# EAGLE design 509_outin_jetson (EAGLE 9.6.2)
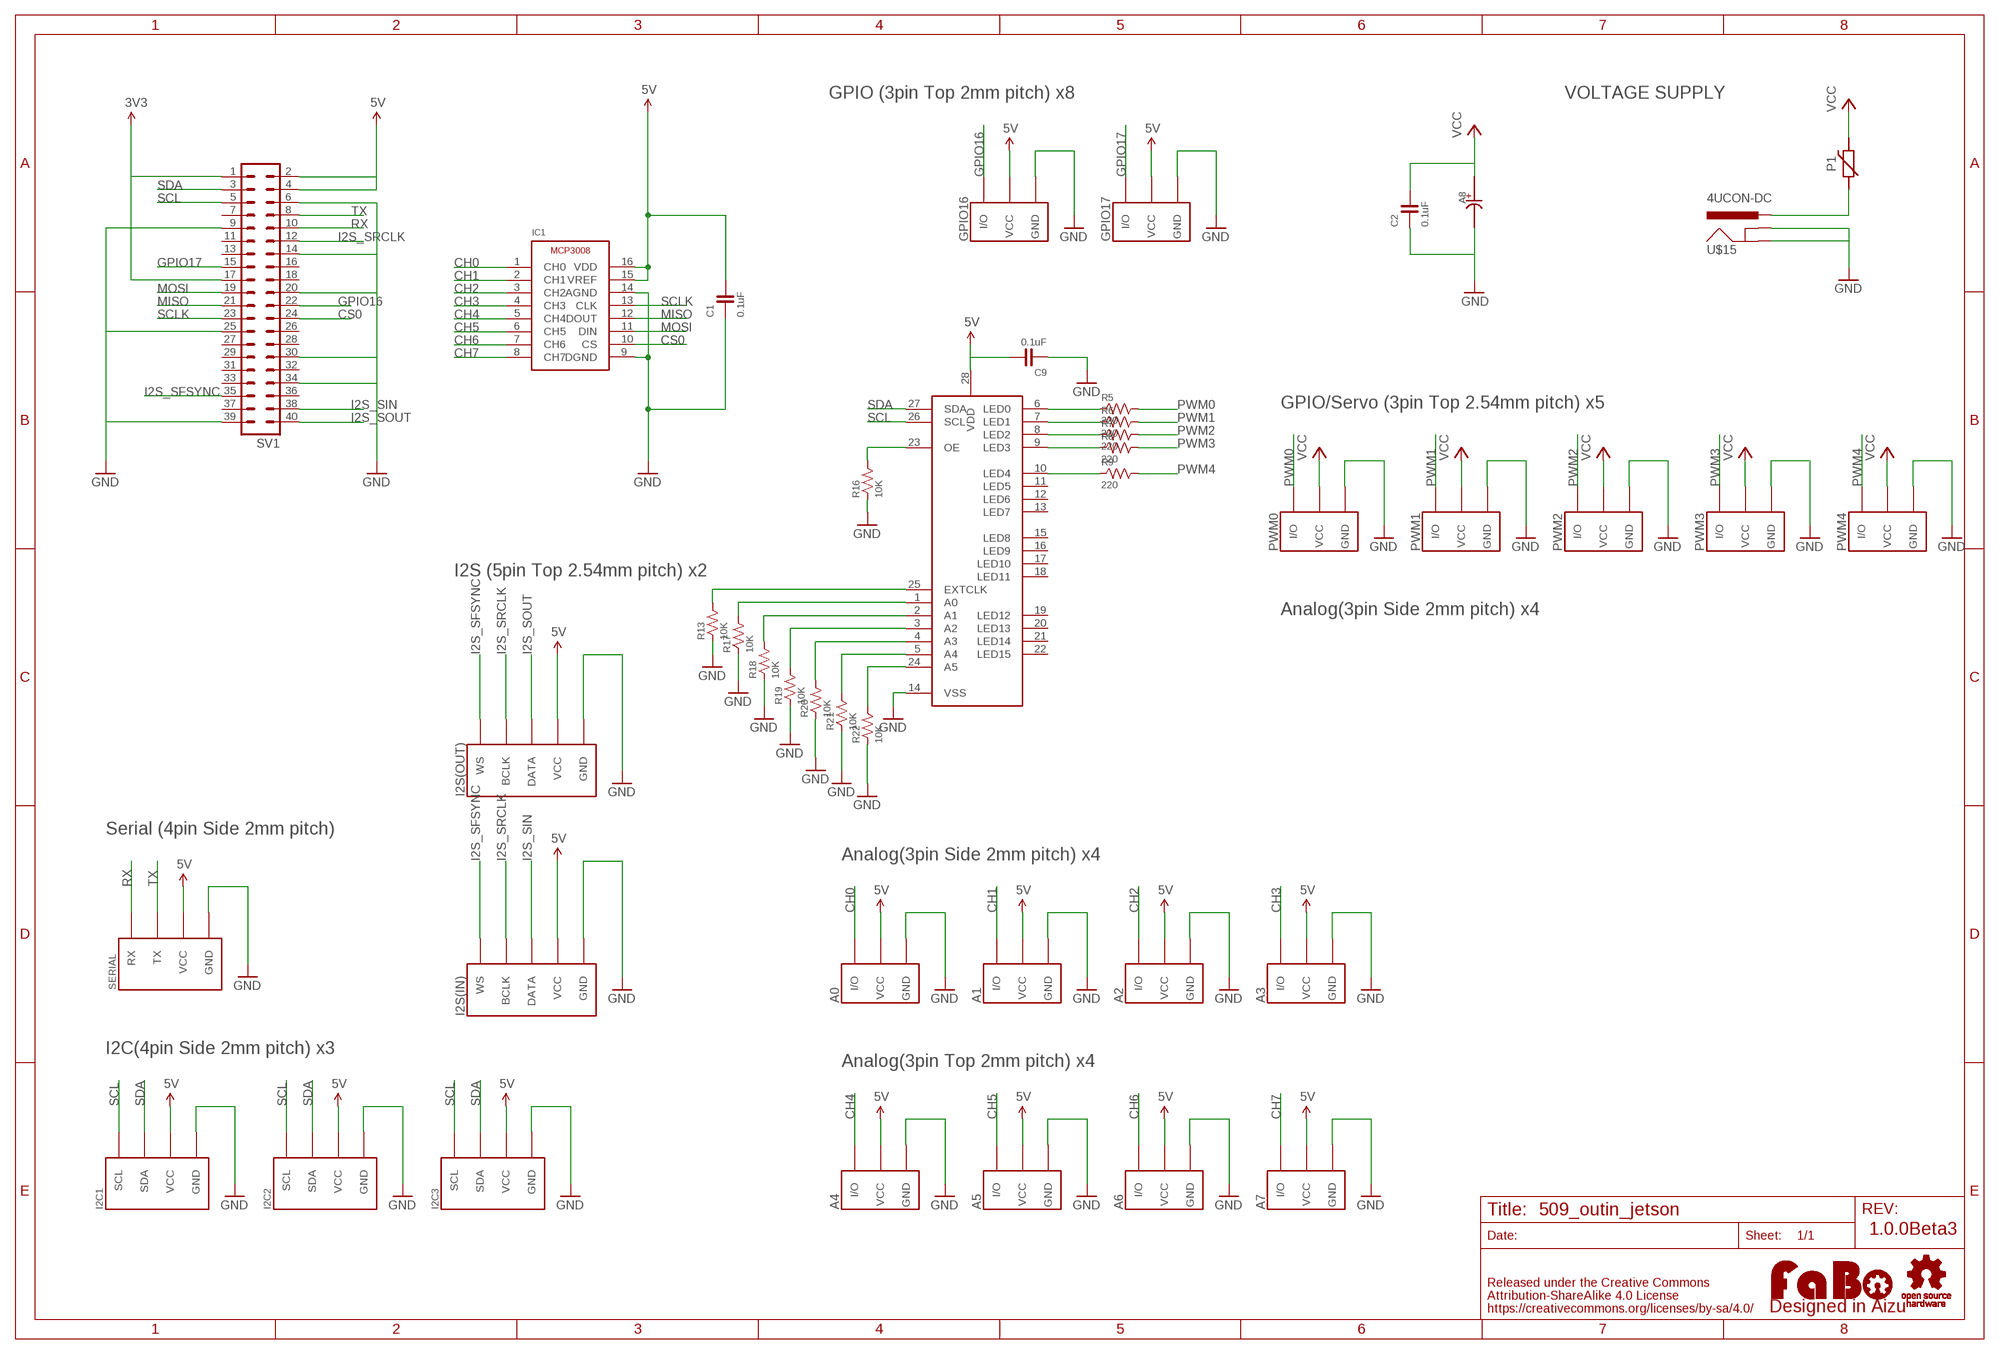
[diagram p0: schematic, sheet 1]

## Parts
A0  FABO_BRICK_3PIN-S03B-PASK-2  [FABO_BRICK_3PIN_S03B-PASK-2]
A1  FABO_BRICK_3PIN-S03B-PASK-2  [FABO_BRICK_3PIN_S03B-PASK-2]
A2  FABO_BRICK_3PIN-S03B-PASK-2  [FABO_BRICK_3PIN_S03B-PASK-2]
A3  FABO_BRICK_3PIN-S03B-PASK-2  [FABO_BRICK_3PIN_S03B-PASK-2]
A4  FABO_BRICK_3PIN-B03B-PASK-1  [FABO_BRICK_3PIN_B03B-PASK-1]
A5  FABO_BRICK_3PIN-B03B-PASK-1  [FABO_BRICK_3PIN_B03B-PASK-1]
A6  FABO_BRICK_3PIN-B03B-PASK-1  [FABO_BRICK_3PIN_B03B-PASK-1]
A7  FABO_BRICK_3PIN-B03B-PASK-1  [FABO_BRICK_3PIN_B03B-PASK-1]
A8  CAPACITOR-ALUMIN_H13  [H13]
C1  0.1uF  CAPACITOR-0603  [0603]
C2  0.1uF  CAPACITOR-0603  [0603]
C9  0.1uF  CAPACITOR-0603  [0603]
GPIO16  FABO_BRICK_3PIN-B03B-PASK-1  [FABO_BRICK_3PIN_B03B-PASK-1]
GPIO17  FABO_BRICK_3PIN-B03B-PASK-1  [FABO_BRICK_3PIN_B03B-PASK-1]
I2C1  FABO_BRICK_I2C-S04B-PASK-2  [FABO_BRICK_I2C_S04B-PASK-2]
I2C2  FABO_BRICK_I2C-S04B-PASK-2  [FABO_BRICK_I2C_S04B-PASK-2]
I2C3  FABO_BRICK_I2C-S04B-PASK-2  [FABO_BRICK_I2C_S04B-PASK-2]
I2S(IN)  FABO_BRICK_I2SLONG  [FABO_BRICK_I2S_S05B-PASK-2_LONG]
I2S(OUT)  FABO_BRICK_I2SLONG  [FABO_BRICK_I2S_S05B-PASK-2_LONG]
IC1  MICROCHIP-MCP3008  [MICROCHIP-MCP3008]
LOGO1  LOGO_FABO-M  [LOGO_FABO_M]
P1  POLYSWITCHMF-NSML1  [1206]
PWM0  FABO_BRICK_3PIN-HEADER  [FABO_BRICK_3PIN_HEADER]
PWM1  FABO_BRICK_3PIN-HEADER  [FABO_BRICK_3PIN_HEADER]
PWM2  FABO_BRICK_3PIN-HEADER  [FABO_BRICK_3PIN_HEADER]
PWM3  FABO_BRICK_3PIN-HEADER  [FABO_BRICK_3PIN_HEADER]
PWM4  FABO_BRICK_3PIN-HEADER  [FABO_BRICK_3PIN_HEADER]
R5  220  RESISTOR-0603  [0603]
R6  220  RESISTOR-0603  [0603]
R7  220  RESISTOR-0603  [0603]
R8  220  RESISTOR-0603  [0603]
R9  220  RESISTOR-0603  [0603]
R13  10K  RESISTOR-0402  [0402]
R16  10K  RESISTOR-0603  [0603]
R17  10K  RESISTOR-0402  [0402]
R18  10K  RESISTOR-0402  [0402]
R19  10K  RESISTOR-0402  [0402]
R20  10K  RESISTOR-0402  [0402]
R21  10K  RESISTOR-0402  [0402]
R22  10K  RESISTOR-0402  [0402]
SERIAL  FABO_BRICK_SERIAL-S04B-PASK-2  [FABO_BRICK_SERIAL_S04B-PASK-2]
SV1  MA20-2  [MA20-2]
U$4  LOGO_OSHW-T_M_BOTTOM  [LOGO_OSHW_T_MS_BOTTOM]
U$9  PCA9685  [PCA9685]
U$15  4UCON-DC  [4UCON-DC]

## Nets
3V3: SV1.1 SV1.17
5V: A0.VCC A1.VCC A2.VCC A3.VCC A4.VCC A5.VCC A6.VCC A7.VCC C1.2 C9.2 GPIO16.VCC GPIO17.VCC I2C1.VCC I2C2.VCC I2C3.VCC I2S(IN).VCC I2S(OUT).VCC IC1.15(VREF) IC1.16(VDD) SERIAL.VCC SV1.2 SV1.4 U$9.28(VDD)
CH0: A0.I/O IC1.1(CH0)
CH1: A1.I/O IC1.2(CH1)
CH2: A2.I/O IC1.3(CH2)
CH3: A3.I/O IC1.4(CH3)
CH4: A4.I/O IC1.5(CH4)
CH5: A5.I/O IC1.6(CH5)
CH6: A6.I/O IC1.7(CH6)
CH7: A7.I/O IC1.8(CH7)
CS0: IC1.10(CS) SV1.24
GND: A0.GND A1.GND A2.GND A3.GND A4.GND A5.GND A6.GND A7.GND A8.MINUS(-) C1.1 C2.1 C9.1 GPIO16.GND GPIO17.GND I2C1.GND I2C2.GND I2C3.GND I2S(IN).GND I2S(OUT).GND IC1.9(DGND) IC1.14(AGND) PWM0.GND PWM1.GND PWM2.GND PWM3.GND PWM4.GND R13.P$1 R16.1 R17.P$1 R18.P$1 R19.P$1 R20.P$1 R21.P$1 R22.P$1 SERIAL.GND SV1.6 SV1.9 SV1.14 SV1.20 SV1.25 SV1.30 SV1.34 SV1.39 U$9.14(VSS) U$15.GND1(GND) U$15.GND2(GNDBREAK)
GPIO16: GPIO16.I/O SV1.22
GPIO17: GPIO17.I/O SV1.15
I2S_SFSYNC: I2S(IN).WS I2S(OUT).WS SV1.35
I2S_SIN: I2S(IN).DATA SV1.38
I2S_SOUT: I2S(OUT).DATA SV1.40
I2S_SRCLK: I2S(IN).BCLK I2S(OUT).BCLK SV1.12
LED0: R5.1 U$9.6(LED0)
LED1: R6.1 U$9.7(LED1)
LED2: R7.1 U$9.8(LED2)
LED3: R8.1 U$9.9(LED3)
LED4: R9.1 U$9.10(LED4)
MISO: IC1.12(DOUT) SV1.21
MOSI: IC1.11(DIN) SV1.19
N$1: P1.P$1 U$15.VCC(PWR)
N$7: R16.2 U$9.23(OE)
N$8: R13.P$2 U$9.25(EXTCLK)
N$9: R17.P$2 U$9.1(A0)
N$10: R18.P$2 U$9.2(A1)
N$11: R19.P$2 U$9.3(A2)
N$12: R20.P$2 U$9.4(A3)
N$13: R21.P$2 U$9.5(A4)
N$14: R22.P$2 U$9.24(A5)
PWM0: PWM0.I/O R5.2
PWM1: PWM1.I/O R6.2
PWM2: PWM2.I/O R7.2
PWM3: PWM3.I/O R8.2
PWM4: PWM4.I/O R9.2
RX: SERIAL.RX SV1.10
SCL: I2C1.SCL I2C2.SCL I2C3.SCL SV1.5 U$9.26(SCL)
SCLK: IC1.13(CLK) SV1.23
SDA: I2C1.SDA I2C2.SDA I2C3.SDA SV1.3 U$9.27(SDA)
TX: SERIAL.TX SV1.8
VCC: A8.PLUS(+) C2.2 P1.P$2 PWM0.VCC PWM1.VCC PWM2.VCC PWM3.VCC PWM4.VCC
Unconnected: SV1.7 SV1.11 SV1.13 SV1.16 SV1.18 SV1.26 SV1.27 SV1.28 SV1.29 SV1.31 SV1.32 SV1.33 SV1.36 SV1.37 U$9.11(LED5) U$9.12(LED6) U$9.13(LED7) U$9.15(LED8) U$9.16(LED9) U$9.17(LED10) U$9.18(LED11) U$9.19(LED12) U$9.20(LED13) U$9.21(LED14) U$9.22(LED15)

## Notes on the sheet
- GPIO (3pin Top 2mm pitch) x8 | VOLTAGE SUPPLY
- GPIO/Servo (3pin Top 2.54mm pitch) x5
- I2S (5pin Top 2.54mm pitch) x2
- Analog(3pin Side 2mm pitch) x4
- Serial (4pin Side 2mm pitch)
- Analog(3pin Side 2mm pitch) x4
- I2C(4pin Side 2mm pitch) x3
- Analog(3pin Top 2mm pitch) x4
- 1.0.0Beta3

## Library data of the parts
A0 A1-A7 GPIO16 GPIO17 PWM0 PWM1-PWM4 = FaBo-Template:FABO_BRICK_3PIN: FaBo Brick 3pin
A8 = FaBo-Capacitor:CAPACITOR-ALUMIN
C1 C2 C9 = FaBo-Capacitor:CAPACITOR: CAPACITOR
I2C1-I2C3 = FaBo-Template:FABO_BRICK_I2C: FaBo Brick I2C
I2S(IN) I2S(OUT) = FaBo-Template:FABO_BRICK_I2S
IC1 = FaBo-ADC:MICROCHIP-MCP3008
LOGO1 = component:LOGO_FABO
P1 = FaBo-Supply:POLYSWITCH
R5-R9 R13 R16-R22 = FaBo-Resistors:RESISTOR: RESISTOR
SERIAL = FaBo-Template:FABO_BRICK_SERIAL: FaBo Brick Serial
SV1 = con-lstb:MA20-2: PIN HEADER; OC_FARNELL: unknown; OC_NEWARK: unknown
U$4 = FaBo-etc:LOGO_OSHW
U$9 = FaBo-Motor:PCA9685
U$15 = FaBo-Supply:4UCON-DC

## Board
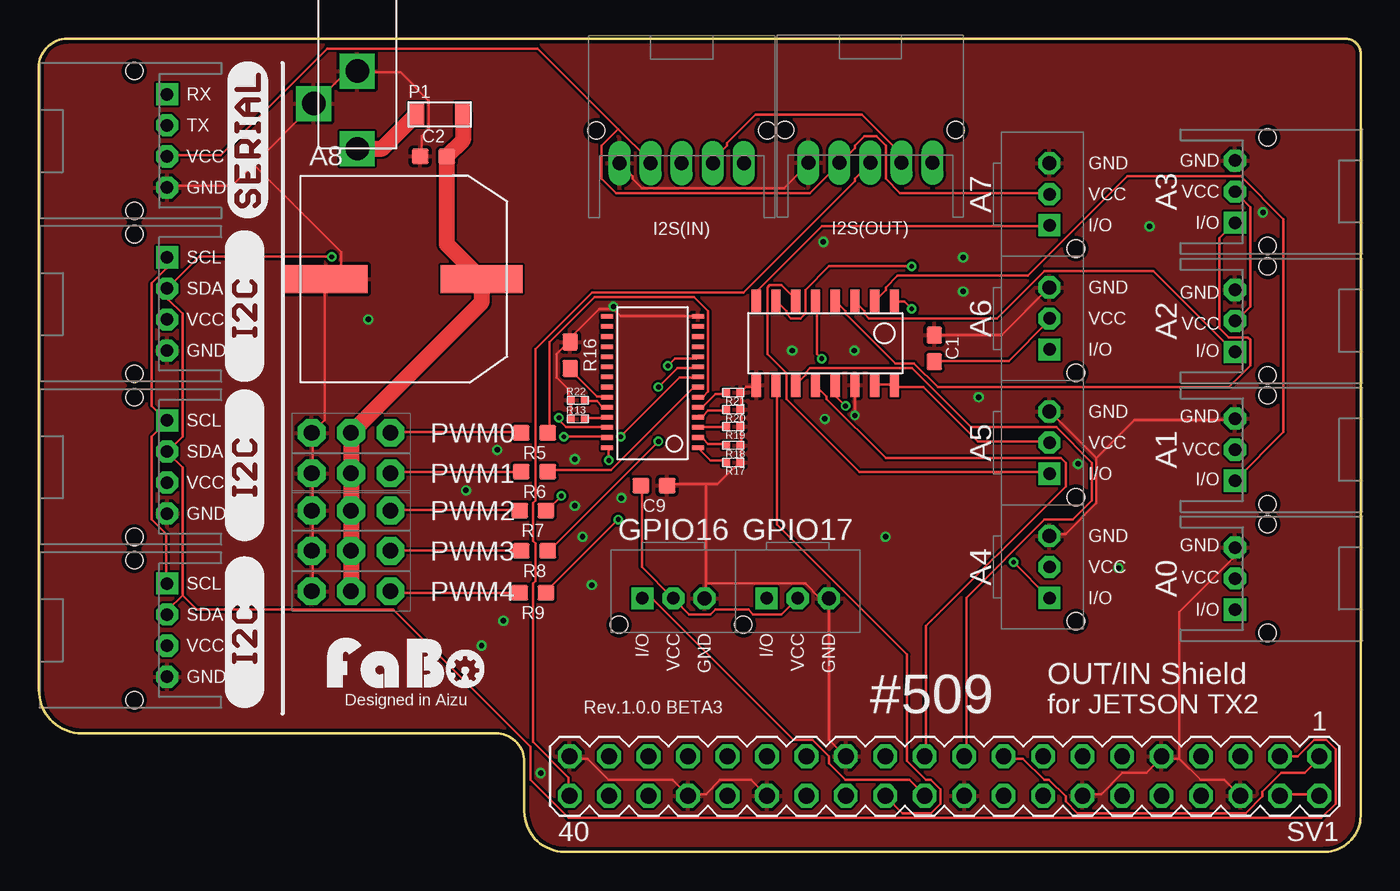
[diagram p1: board, top side]
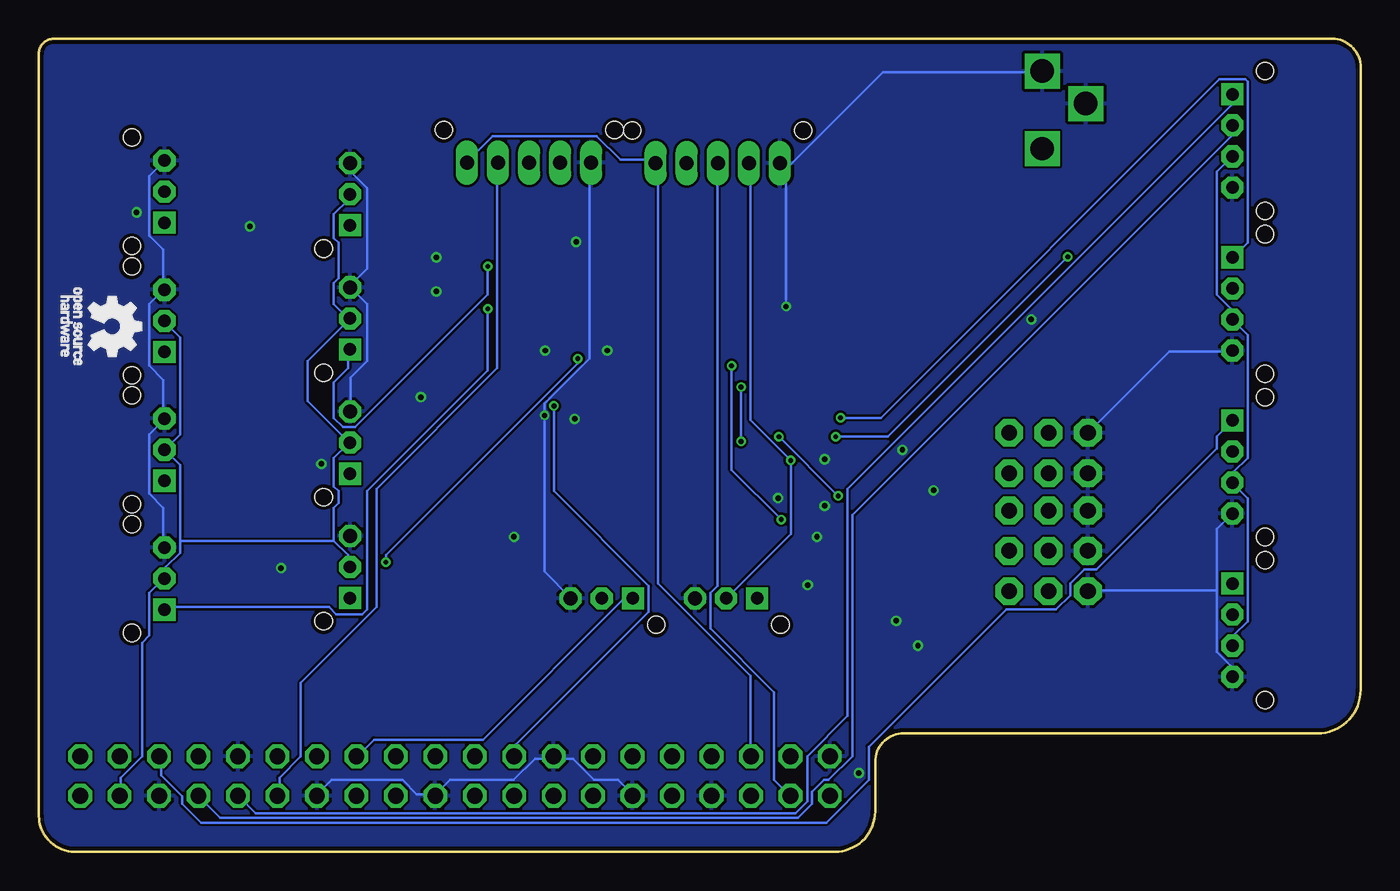
[diagram p2: board, bottom side, seen from below]

Size 85.09 x 52.34 mm. Coordinates in mm from the lower left corner, seen from the top.
Outline: 0,50.52 0,10.41 arc90 2.79,7.62 29.43,7.62 arc-90 31.25,5.79 31.25,2.59 arc90 33.84,0 82.78,0 arc90 85.09,2.31 85.09,51.39 arc90 84.14,52.34 1.83,52.34 arc90 0,50.52
Copper layers (1*16): Top 0.035mm / dielectric 1.6mm / Bottom 0.035mm
Design rules "PCBway": minimum track width 6mil, minimum drill 12mil, track to track 6mil, track to pad 6mil, pad to pad 6mil, via to via 6mil, smd to smd 6mil, copper to edge 10mil, drill to drill 10mil, minimum pad ring 10mil, minimum via ring 6mil, stop-mask expansion 2mil, vias tented up to drill 100mil, thermal gap 8mil

### Footprints (pad centres in the part's own frame; a part is rotated, then mirrored left to right if it is on the bottom)
FABO_BRICK_3PIN_S03B-PASK-2 = drill 0.8 pad 1.422 octagon: GND -2,0; VCC 0,0 | drill 0.8 pad 1.422 square: I/O 2,0 | hole 1.1: 3.5,2.1; -3.5,2.1
FABO_BRICK_3PIN_B03B-PASK-1 = drill 0.9 pad 1.422 octagon: GND -2,0 | drill 0.8 pad 1.422 square: I/O 2,0 | drill 0.8 pad 1.422 octagon: VCC 0,0 | hole 1.1: 3.5,1.7
H13 = smd 5.3 x 1.8: MINUS -5,0; PLUS 5,0
0603 = smd 1.1 x 1: 1 -0.85,0; 2 0.85,0
FABO_BRICK_I2C_S04B-PASK-2 = drill 0.8 pad 1.422 octagon: GND -3,0; SDA 1,0; VCC -1,0 | drill 0.8 pad 1.422 square: SCL 3,0 | hole 1.1: 4.5,2.1; -4.5,2.1
FABO_BRICK_I2S_S05B-PASK-2_LONG = drill 0.9 pad 1.422 long: BCLK 3,0; DATA 1,0; GND -3,0; VCC -1,0; WS 5,0 | hole 1.1: 6.5,2.1; -4.5,2.1
MICROCHIP-MCP3008 = smd 0.6 x 1.5: 1 -4.445,-2.7; 2 -3.175,-2.7; 3 -1.905,-2.7; 4 -0.635,-2.7; 5 0.635,-2.7; 6 1.905,-2.7; 7 3.175,-2.7; 8 4.445,-2.7; 9 4.445,2.7; 10 3.175,2.7; 11 1.905,2.7; 12 0.635,2.7; 13 -0.635,2.7; 14 -1.905,2.7; 15 -3.175,2.7; 16 -4.445,2.7
1206 = smd 1 x 1.6: P$1 -1.5,0; P$2 1.5,0
FABO_BRICK_3PIN_HEADER = drill 1 pad 1.778 octagon: GND -2.54,0; I/O 2.54,0; VCC 0,0
0402 = smd 0.5 x 0.5: P$1 -0.46,0; P$2 0.46,0
FABO_BRICK_SERIAL_S04B-PASK-2 = drill 0.8 pad 1.422 octagon: GND -3,0; TX 1,0; VCC -1,0 | drill 0.8 pad 1.422 square: RX 3,0 | hole 1.1: 4.5,2.1; -4.5,2.1
MA20-2 = drill 1.016 octagon: 1 -24.13,-1.27; 2 -24.13,1.27; 3 -21.59,-1.27; 4 -21.59,1.27; 5 -19.05,-1.27; 6 -19.05,1.27; 7 -16.51,-1.27; 8 -16.51,1.27; 9 -13.97,-1.27; 10 -13.97,1.27; 11 -11.43,-1.27; 12 -11.43,1.27; 13 -8.89,-1.27; 14 -8.89,1.27; 15 -6.35,-1.27; 16 -6.35,1.27; 17 -3.81,-1.27; 18 -3.81,1.27; 19 -1.27,-1.27; 20 -1.27,1.27; 21 1.27,-1.27; 22 1.27,1.27; 23 3.81,-1.27; 24 3.81,1.27; 25 6.35,-1.27; 26 6.35,1.27; 27 8.89,-1.27; 28 8.89,1.27; 29 11.43,-1.27; 30 11.43,1.27; 31 13.97,-1.27; 32 13.97,1.27; 33 16.51,-1.27; 34 16.51,1.27; 35 19.05,-1.27; 36 19.05,1.27; 37 21.59,-1.27; 38 21.59,1.27; 39 24.13,-1.27; 40 24.13,1.27
PCA9685 = smd 0.3 x 0.75: 1 -4.15,-2.93; 2 -3.5,-2.93; 3 -2.85,-2.93; 4 -2.2,-2.93; 5 -1.55,-2.93; 6 -0.9,-2.93; 7 -0.25,-2.93; 8 0.4,-2.93; 9 1.05,-2.93; 10 1.7,-2.93; 11 2.35,-2.93; 12 3,-2.93; 13 3.65,-2.93; 14 4.3,-2.93; 15 4.3,2.92; 16 3.65,2.92; 17 3,2.92; 18 2.35,2.92; 19 1.7,2.92; 20 1.05,2.92; 21 0.4,2.92; 22 -0.25,2.92; 23 -0.9,2.92; 24 -1.55,2.92; 25 -2.2,2.92; 26 -2.85,2.92; 27 -3.5,2.92; 28 -4.15,2.92
4UCON-DC = drill 1.5 square: GND1 0.5,0; GND2 2.6,-2.8; VCC 5.5,0

### Placement (x,y rotation side)
A0  77,17.59 270 top
A1  77,25.88 270 top
A2  77,34.18 270 top
A3  77,42.5 270 top
A4  65.05,18.34 270 top
A5  65.05,26.34 270 top
A6  65.05,34.34 270 top
A7  65.05,42.34 270 top
A8  23.5,36.87 0 top
C1  57.64,32.41 270 top
C2  25.4,44.77 0 top
C9  39.6,23.57 180 top
GPIO16  40.85,16.32 180 top
GPIO17  48.85,16.32 180 top
I2C1  8.25,35.27 90 top
I2C2  8.25,24.77 90 top
I2C3  8.25,14.27 90 top
I2S(IN)  40.38,44.33 0 top
I2S(OUT)  52.53,44.37 0 top
IC1  50.63,32.74 180 top
LOGO1  23.63,10.16 0 top
P1  25.8,47.47 0 top
PWM0  20.1,26.97 0 top
PWM1  20.1,24.37 0 top
PWM2  20.1,21.97 0 top
PWM3  20.1,19.37 0 top
PWM4  20.1,16.77 0 top
R5  31.9,26.97 180 top
R6  31.9,24.47 180 top
R7  31.8,21.97 180 top
R8  31.9,19.37 180 top
R9  31.8,16.67 180 top
R13  34.7,27.87 0 top
R16  34.2,31.97 270 top
R17  44.7,25.07 180 top
R18  44.7,26.17 180 top
R19  44.7,27.37 180 top
R20  44.7,28.47 180 top
R21  44.7,29.57 180 top
R22  34.7,29.07 0 top
SERIAL  8.25,45.77 90 top
SV1  58.3,4.87 180 top
U$2  [LOGO_SILK_I2C]  14.5,20.02 90 top
U$3  [LOGO_SILK_SERIAL2]  14.75,40.77 90 top
U$4  80.4,33.81 90 top
U$5  [LOGO_SILK_I2C]  14.5,9.27 90 top
U$6  [LOGO_SILK_I2C]  14.5,30.27 90 top
U$9  39.5,30.17 90 top
U$15  20.5,50.77 270 top

### Tracks (layer width: path | path; a pad name or v marks a point on that pad's centre or on a via)
3V3
  Top 0.152: SV1.17 62.14,5.99 63.36,5.99 64.73,4.62 65.03,4.62 66.1,3.56 66.1,3.25 66.86,2.49 77.68,2.49 78.75,3.56 78.75,3.86 79.97,5.08 81.49,5.08 82.41,5.99 SV1.1
5V  (via drill 0.3)
  Top 0.152: C1.2 57.72,31.6 62.44,31.6 65.03,34.19 A6.VCC | A7.VCC 65.03,42.42 55.43,42.42 54.52,43.33 54.52,45.47 53.91,46.08 53.15,46.08 52.53,45.47 52.53,45.31 51.62,44.4 I2S(OUT).VCC 51.47,44.25 49.64,42.42 37.14,42.42 36.23,43.33 36.23,45.47 37.3,46.53 | IC1.15 53.91,30.07 54.97,30.07 IC1.16 55.13,29.92 56.95,29.92 60.46,26.42 65.03,26.42 A5.VCC | SV1.4 79.97,3.71 82.41,3.71 SV1.2 | A3.VCC 77.07,42.42 77.99,41.5 77.99,35.1 77.07,34.19 A2.VCC | v36.69,25.2 36.69,25.96 U$9.28 | C9.2 38.82,23.52 38.82,18.34 40.8,16.36 GPIO16.VCC 40.95,16.21 41.87,15.29 43.24,15.29 43.54,15.6 45.68,15.6 45.98,15.29 47.81,15.29 48.73,16.21 GPIO17.VCC | 37.3,46.53 39.28,44.55 I2S(IN).VCC | 37.3,46.53 32.11,51.71 18.55,51.71 11.69,44.86 8.34,44.86 SERIAL.VCC
  Bottom 0.152: A7.VCC 65.18,42.27 65.18,41.96 66.1,41.05 66.1,39.52 65.79,39.22 65.79,36.93 66.1,36.63 66.1,35.26 65.18,34.34 A6.VCC 65.18,34.19 67.78,31.6 67.78,29.01 65.18,26.42 A5.VCC 65.18,26.26 66.1,25.35 66.1,23.52 65.79,23.22 65.79,22.45 66.1,22.15 66.1,20.02 | 66.1,20.02 65.18,19.1 65.18,18.34 A4.VCC | 76,20.02 76,24.89 76.92,25.81 A1.VCC 76.92,25.96 76,26.87 76,33.12 76.92,34.04 A2.VCC | 76,20.02 76,19.25 76.92,18.34 76.92,17.73 A0.VCC 77.07,17.58 77.99,16.66 77.99,13.92 78.44,13.46 78.44,6.15 79.81,4.78 79.81,3.71 SV1.4 | 76,20.02 66.1,20.02 | I2C3.VCC 8.19,13.31 8.19,13.92 7.27,14.83 7.27,22.76 8.19,23.67 I2C2.VCC 8.19,23.82 8.19,24.43 7.27,25.35 7.27,33.27 8.19,34.19 I2C1.VCC 8.34,34.34 8.34,34.95 9.25,35.87 9.25,43.79 8.34,44.7 SERIAL.VCC | GPIO16.VCC 40.8,16.36 36.69,20.47 v36.69,25.2 39.28,27.79 39.28,44.4 I2S(IN).VCC
CH0  (via drill 0.3)
  Top 0.152: v56.19,34.95 55.74,35.41 55.13,35.41 IC1.1
  Bottom 0.152: v56.19,34.95 56.19,30.99 63.97,23.22 63.97,15.6 64.27,15.29 65.95,15.29 66.4,15.75 76.77,15.75 76.92,15.6 A0.I/O
CH1
  Top 0.152: IC1.2 53.91,35.56 54.52,36.17 54.52,36.32 55.28,37.08 63.66,37.08 70.06,43.49 77.38,43.49 80.12,40.74 80.12,27.03 77.07,23.98 A1.I/O
CH2
  Top 0.152: IC1.3 52.53,35.41 53.15,34.8 53.15,34.65 53.45,34.34 61.68,34.34 64.73,37.39 71.74,37.39 76.92,32.21 A2.I/O
CH3
  Top 0.152: IC1.4 51.32,35.41 51.93,34.8 51.93,34.65 55.13,31.45 56.34,31.45 57.87,29.92 76.61,29.92 77.99,31.29 77.99,32.97 77.83,33.12 76.61,33.12 76,33.73 76,39.52 76.92,40.44 A3.I/O
CH4  (via drill 0.3)
  Top 0.152: v50.4,31.75 50.1,32.05 50.1,35.41 IC1.5 | v62.75,18.64 65.03,16.36 A4.I/O
  Bottom 0.152: v50.4,31.75 50.4,31.45 62.75,19.1 v62.75,18.64
CH5
  Top 0.152: IC1.6 48.73,35.56 47.81,36.47 47.05,36.47 46.9,36.32 46.9,32.05 48.12,30.84 48.12,29.16 52.84,24.43 65.03,24.43 A5.I/O
CH6  (via drill 0.3)
  Top 0.152: v56.19,37.69 50.86,37.69 49.34,36.17 49.34,34.65 49.03,34.34 48.42,34.34 48.12,34.65 48.12,34.8 47.51,35.41 IC1.7
  Bottom 0.152: v56.19,37.69 56.19,35.87 64.73,27.33 65.49,27.33 66.1,27.94 66.1,30.23 65.18,31.14 65.18,32.21 A6.I/O
CH7
  Top 0.152: IC1.8 46.29,35.56 46.29,36.17 50.4,40.28 65.03,40.28 A7.I/O
CS0
  Top 0.152: IC1.10 47.51,29.92 47.51,21.08 55.89,12.7 55.89,5.84 57.11,4.62 57.41,4.62 58.02,4.01 58.02,3.1 57.41,2.49 55.58,2.49 54.52,3.56 SV1.24
GND  (via drill 0.3, 0.35)
  Top 0.152: C2.1 24.65,44.86 24.65,46.08 25.1,46.53 25.1,48.36 23.27,50.19 20.53,50.19 U$15.GND1 20.38,50.19 19.77,50.19 17.79,48.21 U$15.GND2 17.64,48.06 13.83,44.25 | 13.83,44.25 12.45,42.88 8.34,42.88 SERIAL.GND | PWM4.GND 17.64,16.82 17.64,19.25 PWM3.GND 17.64,19.41 17.64,21.84 PWM2.GND 17.64,22 17.64,24.28 PWM1.GND 17.64,24.43 17.64,26.87 PWM0.GND 17.64,27.03 18.4,27.79 18.4,36.78 A8.MINUS 18.55,36.93 19.46,37.85 19.46,38.61 13.83,44.25 | 68.08,25.35 68.08,22.45 66.1,20.47 65.18,20.47 A4.GND | 68.08,25.35 65.18,28.25 A5.GND | C1.1 57.72,33.27 61.98,33.27 65.03,36.32 A6.GND | 68.08,25.35 70.52,27.79 76.92,27.79 A1.GND | R13.P$1 34.25,27.94 34.25,29.01 R22.P$1 34.09,29.16 34.09,29.77 33.33,30.53 33.33,32.05 34.09,32.82 R16.1 34.09,32.97 36.08,34.95 36.99,34.95 | 36.99,34.95 37.45,34.49 42.32,34.49 U$9.14 | I2S(IN).GND 37.3,44.4 38.21,43.49 38.21,43.33 38.82,42.72 47.96,42.72 49.49,44.25 I2S(OUT).GND | v36.99,35.1 36.99,34.95 | v52.53,28.09 IC1.14 | 42.93,23.67 43.7,23.67 45.07,25.04 R17.P$1 45.22,25.2 45.22,26.11 R18.P$1 45.22,26.26 45.22,27.33 R19.P$1 45.22,27.48 45.22,28.4 R20.P$1 45.22,28.55 45.22,29.46 R21.P$1 45.22,29.62 45.52,29.92 46.13,29.92 IC1.9 | 42.93,23.67 40.5,23.67 C9.1 | 42.93,23.67 42.93,17.27 | 42.93,17.27 42.93,16.36 GPIO16.GND | 42.93,17.27 49.34,17.27 50.25,16.36 50.71,16.36 GPIO17.GND 50.86,16.21 50.86,7.21 51.93,6.15 SV1.25 | SV1.30 46.74,3.71 45.83,4.62 43.85,4.62 42.93,3.71 41.87,3.71 SV1.34 41.72,3.71 40.8,4.62 36.69,4.62 35.31,5.99 34.25,5.99 SV1.39 | 73.41,5.99 72.35,5.99 SV1.9 72.19,5.99 71.28,5.08 69.76,5.08 68.39,3.71 67.32,3.71 SV1.14
  Top 0.152: 73.41,5.99 74.79,4.62 76.31,4.62 77.22,3.71 SV1.6 | 73.41,5.99 73.41,15.44 76.92,18.95 76.92,19.56 A0.GND
  Bottom 0.152: 9.25,16.82 9.25,20.78 8.34,21.69 I2C2.GND | 9.25,16.82 9.25,12.85 8.34,11.94 8.34,11.33 I2C3.GND | I2C1.GND 8.34,32.21 12.3,32.21 17.48,27.03 PWM0.GND | 9.25,16.82 17.48,16.82 PWM4.GND | A0.GND 77.07,19.71 77.07,22.15 77.99,23.06 77.99,26.87 77.07,27.79 A1.GND 77.07,27.94 77.07,30.38 77.99,31.29 77.99,35.26 77.07,36.17 A2.GND 77.07,36.32 77.07,38.76 77.99,39.68 77.99,43.49 77.07,44.4 A3.GND | A7.GND 65.03,44.25 65.03,43.79 63.97,42.72 63.97,37.54 65.03,36.47 A6.GND 65.03,36.32 63.97,35.26 63.97,31.6 65.03,30.53 65.03,28.4 A5.GND | 36.99,43.94 36.99,44.25 37.14,44.4 I2S(IN).GND 36.99,43.94 | 36.99,43.94 v36.99,35.1 | GPIO17.GND 50.86,16.36 52.53,18.03 v52.53,28.09 52.53,28.85 49.64,31.75 49.64,44.25 I2S(OUT).GND | SV1.30 46.9,3.71 47.81,4.62 49.34,4.62 50.71,5.99 51.93,5.99 SV1.25 52.08,5.99 53.15,5.99 54.52,4.62 58.63,4.62 59.55,3.71 SV1.20 59.7,3.71 60.77,3.71 61.68,4.62 66.25,4.62 67.17,3.71 SV1.14 | 36.99,43.94 30.74,50.19 20.53,50.19 U$15.GND1
  other vias: 54.5,20.27 34.5,22.27 27.5,23.27 28.5,13.27 34.5,25.27 52.5,32.27 48.5,32.27 50.5,39.27 59.5,38.27 60.5,29.27 71.5,40.27 69.5,18.27 59.5,36.07 50.6,27.87 29.5,25.87 35,20.27 37.5,22.77 35.6,17.17 29.9,14.87 21.2,34.27 66.9,24.97 78.8,41.17 32.3,5.07
  pour Bottom: -0.5,-0.73 86.5,-0.73 86.5,55.27 -0.5,55.27
  pour Bottom: -0.5,-0.73 86.5,-0.73 86.5,55.27 -0.5,55.27
  pour Top: -0.5,-0.73 86.5,-0.73 86.5,55.27 -0.5,55.27
GPIO16
  Top 0.152: GPIO16.I/O 38.97,16.21 39.58,16.21 48.57,7.21 49.79,7.21 50.86,6.15 50.86,5.69 51.93,4.62 56.04,4.62 56.95,3.71 SV1.22
GPIO17
  Bottom 0.152: GPIO17.I/O 46.9,16.21 47.51,16.21 56.5,7.21 63.51,7.21 64.58,6.15 SV1.15
I2S_SFSYNC
  Bottom 0.152: I2S(OUT).WS 57.56,44.4 55.89,46.08 49.18,46.08 47.66,44.55 45.37,44.55 I2S(IN).WS 45.22,44.4 45.22,17.27 39.28,11.33 39.28,6.15 SV1.35
I2S_SIN
  Bottom 0.152: I2S(IN).DATA 41.41,44.4 41.41,17.12 41.87,16.66 41.87,14.38 37.75,10.26 37.75,4.62 36.84,3.71 SV1.38
I2S_SOUT
  Top 0.152: I2S(OUT).DATA 53.45,44.25 52.53,43.33 52.53,43.18 45.37,36.02 35.62,36.02 31.96,32.36 31.96,22.61 31.81,22.45 31.81,20.02 31.96,19.86 31.96,17.42 31.81,17.27 31.81,7.06 34.09,4.78 34.09,3.71 SV1.40
I2S_SRCLK
  Top 0.152: I2S(IN).BCLK 43.39,44.55 44.31,45.47 44.31,45.62 46.13,47.45 52.99,47.45 55.43,45.01 55.43,44.4 I2S(OUT).BCLK
  Bottom 0.152: SV1.12 69.6,3.71 69.6,4.78 68.23,6.15 68.23,10.87 63.36,15.75 63.36,23.37 55.58,31.14 55.58,44.25 I2S(OUT).BCLK
LED0
  Top 0.152: U$9.6 42.48,29.31 42.78,29.31 43.09,29.62 43.09,34.8 42.17,35.71 35.77,35.71 32.88,32.82 32.88,27.03 R5.1
LED1
  Top 0.152: U$9.7 42.32,29.92 42.17,29.92 36.84,24.59 32.88,24.59 R6.1
LED2  (via drill 0.3)
  Top 0.152: v37.45,26.72 41.26,30.53 42.32,30.53 U$9.8 | v33.64,22.91 32.72,22 R7.1
  Bottom 0.152: v33.64,22.91 v37.45,26.72
LED3  (via drill 0.3)
  Top 0.152: v39.89,29.92 41.1,31.14 42.32,31.14 U$9.9 | v39.89,26.42 32.88,19.41 R8.1
  Bottom 0.152: v39.89,26.42 v39.89,29.92
LED4  (via drill 0.3)
  Top 0.152: v40.5,31.29 40.95,31.75 42.32,31.75 U$9.10 | v37.3,21.39 32.72,16.82 R9.1
  Bottom 0.152: v40.5,31.29 40.5,24.59 v37.3,21.39
MISO
  Top 0.152: IC1.12 50.1,29.92 50.71,29.31 50.71,29.16 54.52,25.35 65.79,25.35 66.1,25.04 66.1,23.52 57.11,14.53 57.11,6.15 SV1.21
MOSI
  Top 0.152: IC1.11 48.73,30.07 49.34,30.68 49.34,30.84 49.64,31.14 56.19,31.14 60,27.33 65.49,27.33 67.78,25.04 67.78,22.61 66.56,21.39 64.73,21.39 59.7,16.36 59.7,6.15 SV1.19
N$1
  Top 1.016: U$15.VCC 22.1,45.27 P1.P$1
N$7
  Top 0.152: U$9.23 36.53,29.31 35.92,29.31 34.25,30.99 R16.2
N$8
  Top 0.152: R13.P$2 35.16,27.94 36.53,27.94 U$9.25
N$9
  Top 0.152: R17.P$2 44.15,25.2 43.24,25.2 42.48,25.96 U$9.1
N$10
  Top 0.152: R18.P$2 44.15,26.26 43.09,26.26 42.78,26.57 42.48,26.57 U$9.2
N$11
  Top 0.152: R19.P$2 44.15,27.33 42.48,27.33 U$9.3
N$12
  Top 0.152: R20.P$2 44.15,28.4 43.09,28.4 42.78,28.09 42.48,28.09 U$9.4
N$13
  Top 0.152: R21.P$2 44.15,29.46 43.54,29.46 42.78,28.7 42.48,28.7 U$9.5
N$14
  Top 0.152: R22.P$2 35.16,29.01 35.92,29.01 36.23,28.7 36.53,28.7 U$9.24
PWM0
  Top 0.152: R5.2 31.05,27.03 22.66,27.03 PWM0.I/O
PWM1
  Top 0.152: R6.2 31.05,24.43 22.66,24.43 PWM1.I/O
PWM2
  Top 0.152: R7.2 30.89,22 22.66,22 PWM2.I/O
PWM3
  Top 0.152: R8.2 31.05,19.41 22.66,19.41 PWM3.I/O
PWM4
  Top 0.152: R9.2 30.89,16.66 22.66,16.66 PWM4.I/O
RX
  Bottom 0.152: SERIAL.RX 8.34,48.67 8.34,48.06 33.03,23.37 33.03,8.74 35.62,6.15 35.62,3.25 36.38,2.49 71.13,2.49 72.19,3.56 SV1.10
SCL  (via drill 0.3)
  Top 0.152: v33.48,27.94 33.48,27.79 33.94,27.33 36.53,27.33 U$9.26 | I2C3.SCL 8.19,17.27 8.19,20.47 7.27,21.39 7.27,26.72 8.19,27.63 I2C2.SCL 8.19,27.79 7.27,28.7 7.27,36.63 8.19,37.54 8.19,38.15 I2C1.SCL
  Bottom 0.152: v33.48,27.94 30.89,27.94 9.1,49.73 7.42,49.73 7.27,49.58 7.27,39.22 8.19,38.3 I2C1.SCL | SV1.5 77.22,5.99 77.22,4.93 75.85,3.56 75.85,3.1 74.63,1.88 34.4,1.88 31.66,4.62 31.66,6.76 22.82,15.6 19.62,15.6 18.7,16.51 18.7,17.27 17.79,18.19 17.03,18.19 9.25,25.96 9.25,26.72 8.34,27.63 I2C2.SCL
SCLK  (via drill 0.3)
  Top 0.152: v51.93,28.7 51.32,29.31 51.32,29.92 IC1.13
  Bottom 0.152: v51.93,28.7 51.93,23.22 45.83,17.12 45.83,15.44 54.36,6.91 54.36,6.15 SV1.23
SDA  (via drill 0.3)
  Top 0.152: v33.79,26.72 36.53,26.72 U$9.27 | v18.86,38.3 10.32,38.3 8.34,36.32 I2C1.SDA 8.34,36.17 8.34,35.56 9.25,34.65 9.25,26.72 8.34,25.81 I2C2.SDA 8.34,25.65 9.25,24.74 9.25,16.51 | 9.25,16.51 8.34,15.6 8.34,15.29 I2C3.SDA | 9.25,16.51 10.17,15.6 22.82,15.6 31.66,6.76 31.66,4.62 34.09,2.18 82.56,2.18 83.47,3.1 83.47,6.6 82.86,7.21 82.1,7.21 81.03,6.15 79.97,6.15 SV1.3
  Bottom 0.152: v33.79,26.72 30.44,26.72 v18.86,38.3
TX
  Bottom 0.152: SERIAL.TX 8.34,46.69 8.34,46.08 32.72,21.69 32.72,6.15 34.25,4.62 34.55,4.62 35.31,3.86 35.31,3.1 36.23,2.18 73.41,2.18 74.79,3.56 SV1.8
VCC
  Top 1.016: P1.P$2 27.3,45.82 C2.2 26.25,39.12 A8.PLUS 28.5,35.37 PWM0.VCC PWM1.VCC PWM2.VCC PWM3.VCC PWM4.VCC

### Text on the board
tPlace: RX | TX | VCC | GND | GND | GND | VCC | VCC | I/O | I/O | SCL | SDA | GND | GND | VCC | VCC | VCC | GND | I/O | I/O | GND | GND | SCL | VCC | VCC | SDA | I/O | I/O | VCC | GND | GND | GND | VCC | SCL | VCC | I/O | SDA | I/O | I/O | VCC | GND | I/O | VCC | GND | VCC | GND | OUT/IN Shield | Designed in Aizu | Rev.1.0.0 BETA3 | #509 | for JETSON TX2